# Altium schematic sheet Amplifier.SchDoc: =ProjectName
size 420 x 297 mm; Author: T.P.; CompanyName: WUT; DrawnBy: T.P.; Organization: WUT ISE; Address1: Warsaw Univeristy of Technology; Address2: Nowowiejska 15/19; DocumentNumber: 19; Revision: 0.9; SheetNumber: 19; SheetTotal: 36; EDA_Number: ARTIQ; Projet: ARTIQ/SINARA; ModifiedBy: -; CreateDate: XX/XX/XXXX; CheckedDate: -; Title2: Amplifier.SchDoc; DivGrp: ISE; Designer: G.K. and T.P.
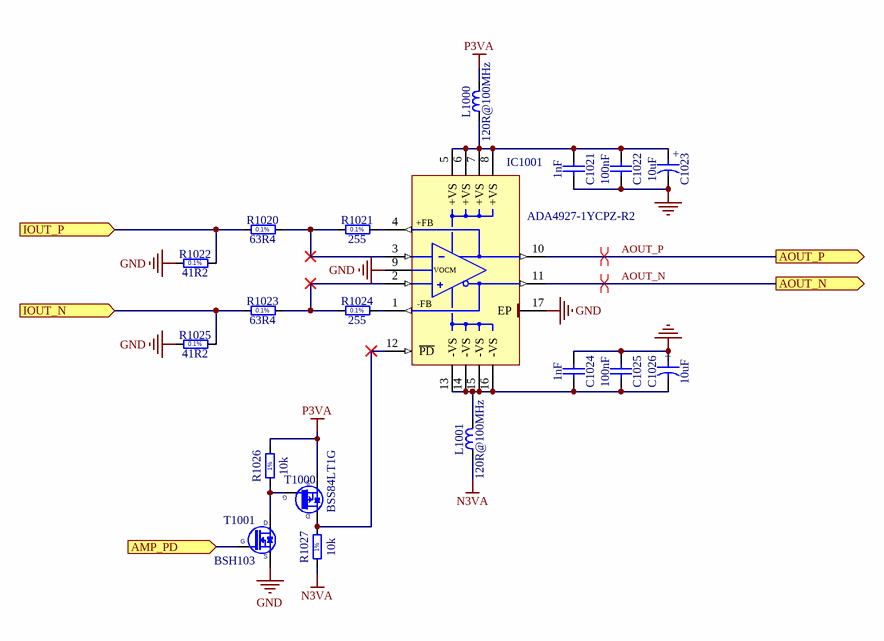
[diagram p0: Amplifier.SchDoc]

## Parts
C1021  1nF  [CAPC0603X33N]
C1022  100nF  [CAPC0603X33N]
C1023  10uF  [CAPMP3216X180N]
C1024  1nF  [CAPC0603X33N]
C1025  100nF  [CAPC0603X33N]
C1026  10uF  [CAPMP3216X180N]
IC1001  ADA4927-1YCPZ-R2  [QFN50P300X300X100-17N-S145]
L1000  120R@100MHz  [INDC1608X95N]
L1001  120R@100MHz  [INDC1608X95N]
R1020  63R4  [RESC1005X35N]
R1021  255  [RESC1608X55N]
R1022  41R2  [RESC1608X55N]
R1023  63R4  [RESC1005X35N]
R1024  255  [RESC1608X55N]
R1025  41R2  [RESC1608X55N]
R1026  10k  [RESC1005X40N]
R1027  10k  [RESC1005X40N]
T1000  BSS84LT1G  [SOT95P240X110-3N]
T1001  BSH103  [SOT95P230X110-3N]

## Ports
AMP_PD (in), AOUT_N (out), AOUT_P (out), IOUT_N (in), IOUT_P (in)

## Nets
GND: C1021.2 C1022.2 C1023.2 C1024.2 C1025.2 C1026.1 IC1001.9(VOCM) IC1001.17(EP) R1022.1 R1025.1 T1001.2(S)
N3VA: L1001.1 R1027.2
P3VA: L1000.2 R1026.1 T1000.2(S)
AMP_PD: T1001.1(G) ; port AMP_PD
AOUT_N: IC1001.11(-OUT) ; port AOUT_N
AOUT_P: IC1001.10(+OUT) ; port AOUT_P
IOUT_N: R1023.1 R1025.2 ; port IOUT_N
IOUT_P: R1020.1 R1022.2 ; port IOUT_P
NetC1021_1: C1021.1 C1022.1 C1023.1 IC1001.5(+VS) IC1001.6(+VS) IC1001.7(+VS) IC1001.8(+VS) L1000.1
NetC1024_1: C1024.1 C1025.1 C1026.2 IC1001.13(-VS) IC1001.14(-VS) IC1001.15(-VS) IC1001.16(-VS) L1001.2
NetIC1001_1: IC1001.1(-FB) R1024.2
NetIC1001_2: IC1001.2(+IN) R1023.2 R1024.1
NetIC1001_3: IC1001.3(-IN) R1020.2 R1021.1
NetIC1001_4: IC1001.4(+FB) R1021.2
NetIC1001_12: IC1001.12(~{PD}) R1027.1 T1000.3(D)
NetR1026_2: R1026.2 T1000.1(G) T1001.3(D)

## Layout directives
differential pair; differential pair class V_analog: AOUT_N, AOUT_P

## Notes on the sheet
- Project/Equipment
- Document
- Designer
- Drawn by
- Check.by
- File
- Last Mod.
- Print Date
- Sheet
- Size
- A3
- of
- Rev
- (in symbol CTE3216-18_10UF_10V_10%_LESR1800) +
- (in symbol R0402_10K_1%_0.0625W_100PPM) 1%
- (in symbol R0402_63R4_0.1%_0.063W_10PPM) 0.1%
- (in symbol R0603_41R2_0.1%_0.063W_10PPM) 0.1%
- (in symbol R0603_255R_0.1%_0.063W_10PPM) 0.1%

## Library data of the parts
C1021 C1024 = CC0201_1NF_16V_10%_X5R: Non-polarised capacitor; Part Description: SMD Multilayer Chip Ceramic Capacitor; Manufacturer: GENERIC; Manufacturer1 Part Number: 0201YD102KAT2A; Voltage: 16V; TC: X5R; Tolerance: ±10%; Part Number: CC0201_1NF_16V_10%_X5R; Component Kind: Standard; Component Type: Standard; Pin Count: 2; Value: 1nF; Status: Not Recommended; Manufacturer Part Number: CC0201_1NF_16V_10%_X5R; Case: 0201; Mounted: Yes; Socket: No; SMD: Yes; Sense: No; Manufacturer1 Example: AVX; Manufacturer1 ComponentHeight: 0.33mm; HelpURL: \\cern.ch\dfs\Applications\Altium\Datasheets\CC0201_X5R_AVX.pdf; Author: CERN DEM JLC; CreateDate: 03.12.2007; LatestRevisionDate: 03.12.2007
C1022 C1025 = CC0201_100NF_6.3V_10%_X5R: Non-polarised capacitor; Part Description: SMD Multilayer Chip Ceramic Capacitor; Manufacturer: GENERIC; Manufacturer1 Part Number: 02016D104KAT2A; Voltage: 6.3V; TC: X5R; Tolerance: ±10%; Part Number: CC0201_100NF_6.3V_10%_X5R; Component Kind: Standard; Component Type: Standard; Pin Count: 2; Value: 100nF; Status: Not Recommended; Manufacturer Part Number: CC0201_100NF_6.3V_10%_X5R; Case: 0201; Mounted: Yes; Socket: No; SMD: Yes; Sense: No; Manufacturer1 Example: AVX; Manufacturer1 ComponentHeight: 0.33mm; HelpURL: \\cern.ch\dfs\Applications\Altium\Datasheets\CC0201_X5R_AVX.pdf; Author: CERN DEM JLC; CreateDate: 03.12.2007; LatestRevisionDate: 03.12.2007
C1023 C1026 = CTE3216-18_10UF_10V_10%_LESR1800: Polarised capacitor; Part Description: Low ESR 1R8 Solid Tantalum Chip Capacitor; Manufacturer: GENERIC; Manufacturer1 Part Number: TPSA106K010R1800; Voltage: 10V; Tolerance: ±10%; Part Number: CTE3216-18_10UF_10V_10%_LESR1800; Component Kind: Standard; Component Type: Standard; Pin Count: 2; Value: 10uF; Status: Preferred; Manufacturer Part Number: CTE3216-18_10UF_10V_10%_LESR1800; Case: A; Mounted: Yes; Socket: No; SMD: Yes; Sense: No; Manufacturer1 Example: AVX; Manufacturer1 ComponentHeight: 1.8mm; HelpURL: \\cern.ch\dfs\Applications\Altium\Datasheets\CTE-LESR_AVX_TPS.pdf; Author: CERN DEM JLC; CreateDate: 05.05.2008; LatestRevisionDate: 20.01.2009
IC1001 = ADA4927-1YCPZ-R2: Ultralow Distortion Current Feedback Differential ADC Driver; Manufacturer: ANALOG DEVICES; PressFit: No; Bonding: No; Part Number: ADA4927-1YCPZ-R2; Component Kind: Standard; Component Type: Standard; Device: ADA4927-1YCPZ-R2; PackageDescription: QFN,0.50mm pitch,square; 4 pin X 4 pin, 3mm X 3mm X 1.00mm H body (w/thermal tab 1.45 X 1.45mm),  IPC Medium Density; Part Description: Ultralow Distortion Current Feedback Differential ADC Driver; Manufacturer Part Number: ADA4927-1YCPZ-R2; Pin Count: 17; Case: QFN16; Mounted: Yes; Socket: No; SMD: Yes; Sense: No; ComponentHeight: 1mm; Author: CERN DEM JLC; HelpURL: \\cern.ch\dfs\Applications\Altium\Datasheets\ADA4927-1YCPZ-R2.pdf; CreateDate: 19.04.2010; LatestRevisionDate: 19.04.2010
L1000 L1001 = IND0603_MURATA_BLM18PG121SN1D: Inductor; Part Description: SMD EMIFIL Chip Ferrite Bead; Manufacturer: MURATA; Power: 2A; Resistance: 0.05R; Part Number: IND0603_MURATA_BLM18PG121SN1D; Component Kind: Standard; Component Type: Standard; Pin Count: 2; Value: 120R@100MHz; Status: None; Manufacturer Part Number: BLM18PG121SN1D; Case: 0603; Mounted: Yes; Socket: No; SMD: Yes; Sense: No; ComponentHeight: 0.95mm; HelpURL: \\cern.ch\dfs\Applications\Altium\Datasheets\IND0603_MURATA_BLM18P.pdf; Author: CERN DEM BC; CreateDate: 27.07.2015; LatestRevisionDate: 27.07.2015
R1020 R1023 = R0402_63R4_0.1%_0.063W_10PPM: Resistor - 0.1%; Manufacturer: GENERIC; Manufacturer1 Part Number: RN73C1E63R4BTD; Part Description: Thin Film Chip Resistor; Authorr: TPrzywoz; Power: 0.063W; PressFit: No; TC: ±10ppm; Component Kind: Standard; Component Type: Standard; CreateDate: 06.12.2018; LatestRevisionDate: 09.03.2017; Manufacturer Part Number: R0402_63R4_0.1%_0.063W_10PPM; Manufacturer1 ComponentHeight: 0.35mm; Case: 0402; Manufacturer1 Example: TE Connectivity Passive Product; Mounted: Yes; Part Number: R0402_63R4_0.1%_0.063W_10PPM; Pin Count: 2; Sense: No; SMD: Yes; Socket: No; Status: Not Recommended; Tolerance: ±0.1%; Value: 63R4
R1021 R1024 = R0603_255R_0.1%_0.063W_10PPM: Resistor - 0.1%; Part Description: Thin Film Chip Resistor; Manufacturer: GENERIC; Manufacturer1 Part Number: RN73C1J255RBTDF; Power: 0.063W; TC: ±10ppm; PressFit: No; Part Number: R0603_255R_0.1%_0.063W_10PPM; Component Kind: Standard; Component Type: Standard; Pin Count: 2; Value: 255; Status: Not Recommended; Tolerance: ±0.1%; Manufacturer Part Number: R0603_255R_0.1%_0.063W_10PPM; Case: 0603; Mounted: Yes; Sense: No; Socket: No; SMD: Yes; Manufacturer1 Example: TYCO HOLSWORTHY; Manufacturer1 ComponentHeight: 0.5mm; HelpURL: \\cern.ch\dfs\Applications\Altium\Datasheets\R0603_Tyco_RN73.pdf; Author: CERN DEM JLC; CreateDate: 03.12.2007; LatestRevisionDate: 13.03.2008
R1022 R1025 = R0603_41R2_0.1%_0.063W_10PPM: Resistor - 0.1%; Part Description: Thin Film Chip Resistor; Manufacturer: GENERIC; Manufacturer1 Part Number: RN73C1J41R2BTDF; Power: 0.063W; TC: ±10ppm; PressFit: No; Part Number: R0603_41R2_0.1%_0.063W_10PPM; Component Kind: Standard; Component Type: Standard; Pin Count: 2; Value: 41R2; Status: Not Recommended; Tolerance: ±0.1%; Manufacturer Part Number: R0603_41R2_0.1%_0.063W_10PPM; Case: 0603; Mounted: Yes; Sense: No; Socket: No; SMD: Yes; Manufacturer1 Example: TYCO HOLSWORTHY; Manufacturer1 ComponentHeight: 0.5mm; HelpURL: \\cern.ch\dfs\Applications\Altium\Datasheets\R0603_Tyco_RN73.pdf; Author: CERN DEM JLC; CreateDate: 03.12.2007; LatestRevisionDate: 13.03.2008
R1026 R1027 = R0402_10K_1%_0.0625W_100PPM: Resistor - 1%; Manufacturer: GENERIC; Part Description: General Purpose Thick Film Chip Resistor; Manufacturer1 Part Number: 232270671003L; TC: ±100ppm/°C; PressFit: No; Manufacturer Part Number: R0402_10K_1%_0.0625W_100PPM; Part Number: R0402_10K_1%_0.0625W_100PPM; Tolerance: ±1%; Value: 10k; Component Kind: Standard; Component Type: Standard; Pin Count: 2; Status: Not Recommended; Power: 0.0625W; Case: 0402; Mounted: Yes; Sense: No; Socket: No; SMD: Yes; Manufacturer1 Example: YAGEO PHYCOMP; Manufacturer1 ComponentHeight: 0.4mm; HelpURL: \\cern.ch\dfs\Applications\Altium\Datasheets\R0402_Phycomp_RC0402.pdf; Author: CERN DEM JLC; CreateDate: 03.12.2007; LatestRevisionDate: 17.10.2012
T1000 = BSS84LT1G: P-CHANNEL MOSFET WITH DIODE; Part Description: 50V 130mA Single P-Channel Power MOSFET; Manufacturer: ON SEMICONDUCTOR; PressFit: No; Bonding: No; Part Number: BSS84LT1G; Component Kind: Standard; Component Type: Standard; Device: BSS84LT1G; PackageDescription: SOT23 3-Leads, Pitch 0.95mm - Body 1.4x3mm, IPC Medium Density; Manufacturer Part Number: BSS84LT1G; Pin Count: 3; Case: SOT23-3; Mounted: Yes; Socket: No; SMD: Yes; Sense: No; ComponentHeight: 1.1mm; HelpURL: \\cern.ch\dfs\Applications\Altium\Datasheets\BSS84LT1G.pdf; Author: CERN DEM JLC; CreateDate: 29.03.2012; LatestRevisionDate: 29.03.2012
T1001 = BSH103: N-CHANNEL MOSFET WITH DIODE; Manufacturer: NEXPERIA; Part Description: 30V 850mA N-Channel Enhancement Mode Field-Effect Transistor; PressFit: No; Bonding: No; Manufacturer Part Number: BSH103; PackageDescription: SOT23, 3 pin, Pitch 0.95mm - 1.3mm W X 2.9mm L X 1.1mm H, IPC Medium Density; Part Number: BSH103; Component Kind: Standard; Component Type: Standard; Device: BSH103; Pin Count: 3; Case: SOT23-3; Mounted: Yes; Socket: No; SMD: Yes; Sense: No; ComponentHeight: 1.1mm; HelpURL: \\cern.ch\dfs\Applications\Altium\Datasheets\BSH103.pdf; Author: CERN DEM JLC; CreateDate: 16.03.2010; LatestRevisionDate: 20.06.2017